# Altium schematic sheet BT_Header.SchDoc
size A4; DocumentNumber: 9; SheetNumber: 9; SheetTotal: 11
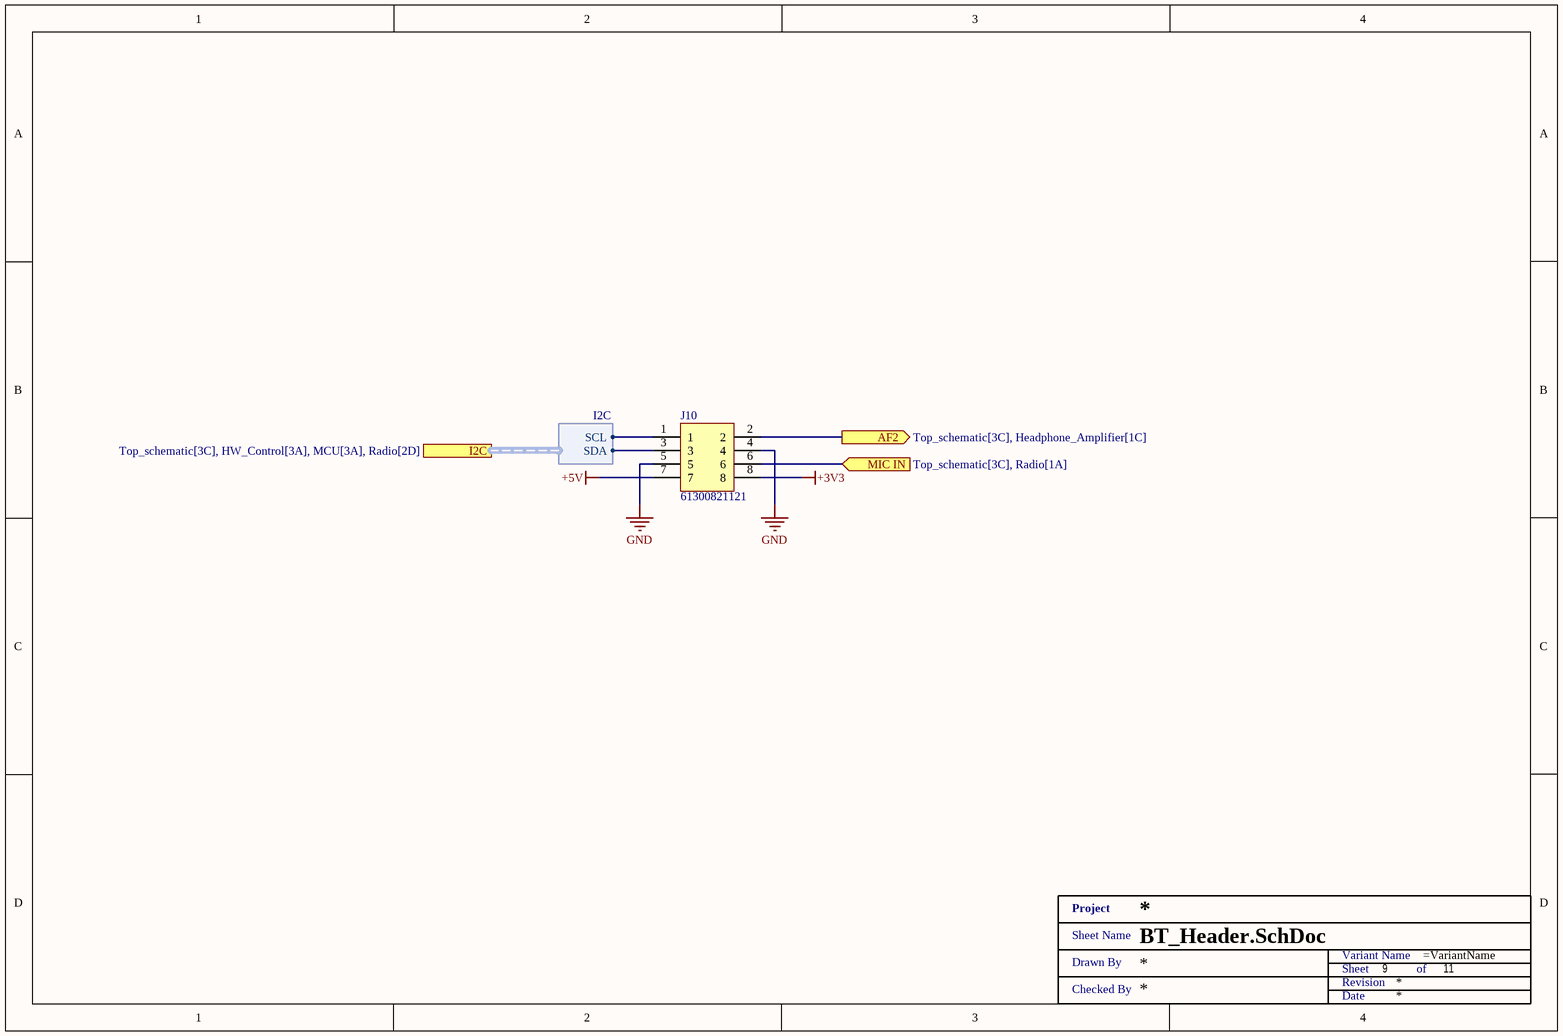
[diagram p0: BT_Header.SchDoc]

## Parts
J10  61300821121  [61300821121]
XX?  Title 1  (value not drawn)  (graphical)

## Ports
AF2 (out, see Top_schematic[3C], Headphone_Amplifier[1C]), I2C (harness I2C, see Top_schematic[3C], HW_Control[3A], MCU[3A], Radio[2D]), MIC IN (in, see Top_schematic[3C], Radio[1A])

## Harnesses
I2C: SCL, SDA

## Nets
+3V3: J10.8
+5V: J10.7
GND: J10.4 J10.5
AF2: J10.2 ; port AF2
MIC IN: J10.6 ; port MIC IN
NetJ10_1: J10.1 ; port I2C.SCL
NetJ10_3: J10.3 ; port I2C.SDA

## Notes on the sheet
- (in symbol Title 1) Project; Sheet Name; Variant Name; Drawn By; Sheet; of; Revision; Checked By; Date

## Library data of the parts
J10 = 61300821121: CONN HEADER DUAL 8 POS 2.54; Manufacturer: Wurth Electronics; Number of Positions: 8; Gender: Male; Connector Type: Male Pin; Pitch: 0.1inch; Supplier 1: Mouser; Supplier Part Number 1: 710-61300821121; Manufacturer Part Number: 61300821121; RoHS: Yes; Category: Connectors; Stock 1: 1828; Pricing 1: 1=0,66000, 10=0,55700, 50=0,38700, 100=0,35200, 1000=0,32000, 10000=0,32000 (USD); Mount: Through Hole; Contact Plating: Gold; Contact Material: Copper; Color: Black; Number of Rows: 2; Packaging: Bulk; Termination: Solder; Number of Contacts: 8; Row Spacing: 0.1inch; Contact Mating Length: 0.236inch; REACH SVHC: Unknown; Lead Free: Lead Free; ComponentLink1URL: https://datasheet.ciiva.com/28505/1442180-28505510.pdf?src-supplier=Element14; ComponentLink1Description: https://datasheet.ciiva.com/28505/1442180-28505510.pdf?src-supplier=Element14; Supplier 2: Farnell; Supplier Part Number 2: 2356133; Supplier 3: Digi-Key; Supplier Part Number 3: 732-5296-ND